# EAGLE design SparkFun_Bar_Graph_Breakout (EAGLE 7.2.0)
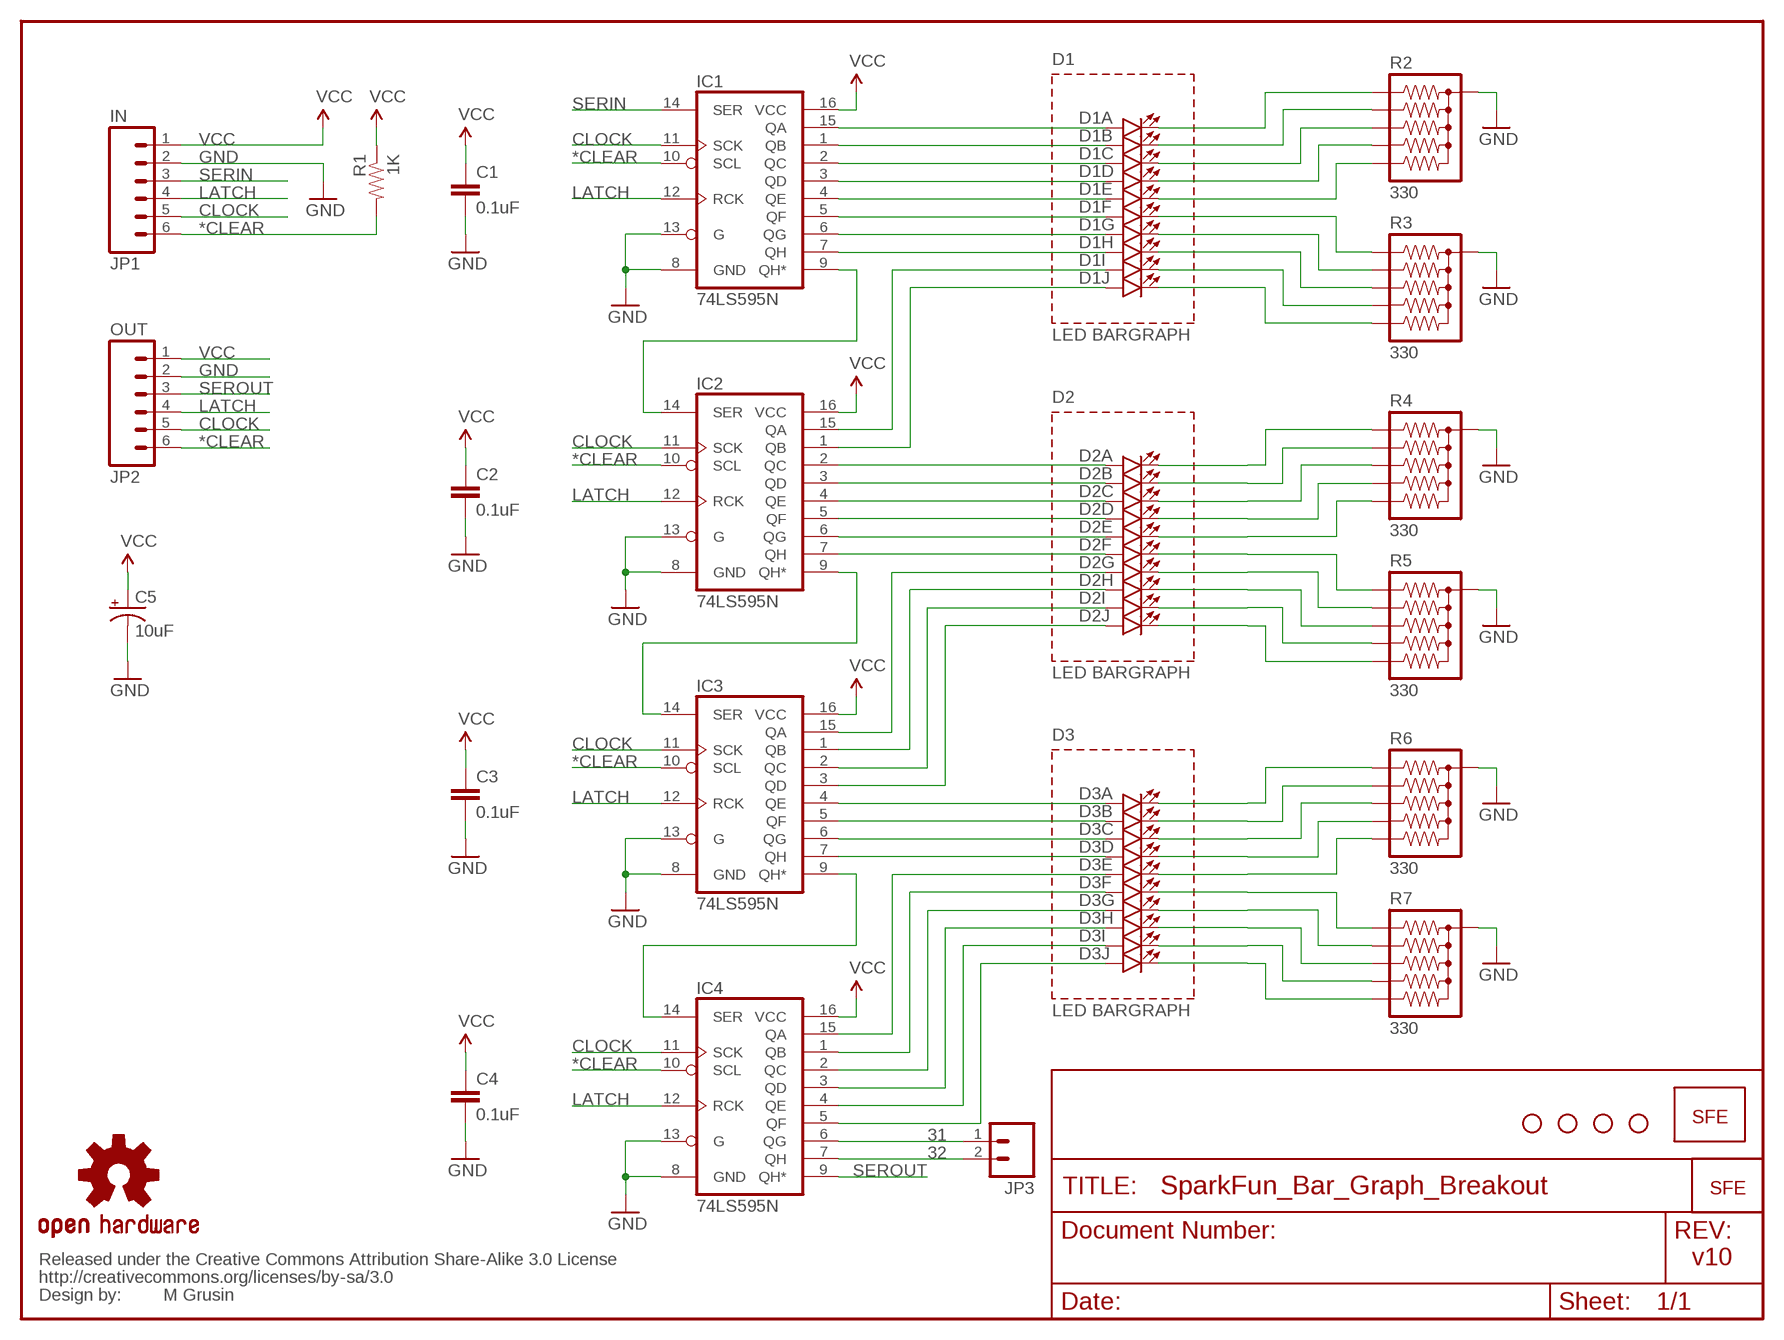
[diagram p0: schematic, sheet 1]

## Parts
C1  0.1uF  CAPPTH2  [CAP-PTH-SMALL2]
C2  0.1uF  CAPPTH2  [CAP-PTH-SMALL2]
C3  0.1uF  CAPPTH2  [CAP-PTH-SMALL2]
C4  0.1uF  CAPPTH2  [CAP-PTH-SMALL2]
C5  10uF  CAP_POLPTH2  [CPOL-RADIAL-10UF-25V]
D1  LED_BARGRAPH_10  [LED_BARGAPH_10]
D2  LED_BARGRAPH_10  [LED_BARGAPH_10]
D3  LED_BARGRAPH_10  [LED_BARGAPH_10]
IC1  74LS595N  [DIL16]
IC2  74LS595N  [DIL16]
IC3  74LS595N  [DIL16]
IC4  74LS595N  [DIL16]
JP1  IN  M06SIP  [1X06]
JP2  OUT  M06SIP  [1X06]
JP3  M02PTH  [1X02]
LOGO1  LOGO-SFENW2  [SFE-NEW-WEB]
LOGO2  LOGO-SFESK  [SFE-LOGO-FLAME]
R1  1K  RESISTORAXIAL-0.3  [AXIAL-0.3]
R2  330  RPACK-BUSSED-SIP-PTH-5  [RPACK-SIP-PTH-5]
R3  330  RPACK-BUSSED-SIP-PTH-5  [RPACK-SIP-PTH-5]
R4  330  RPACK-BUSSED-SIP-PTH-5  [RPACK-SIP-PTH-5]
R5  330  RPACK-BUSSED-SIP-PTH-5  [RPACK-SIP-PTH-5]
R6  330  RPACK-BUSSED-SIP-PTH-5  [RPACK-SIP-PTH-5]
R7  330  RPACK-BUSSED-SIP-PTH-5  [RPACK-SIP-PTH-5]
SO1  STAND-OFF  [STAND-OFF]
SO2  STAND-OFF  [STAND-OFF]
SO3  STAND-OFF  [STAND-OFF]
SO4  STAND-OFF  [STAND-OFF]
U$5  OSHW-LOGOM  [OSHW-LOGO-M]
U$6  CREATIVE_COMMONS  [CREATIVE_COMMONS]

## Nets
31: IC4.6(QG) JP3.1
32: IC4.7(QH) JP3.2
*CLEAR: IC1.10(SCL) IC2.10(SCL) IC3.10(SCL) IC4.10(SCL) JP1.6 JP2.6 R1.P$2
CLOCK: IC1.11(SCK) IC2.11(SCK) IC3.11(SCK) IC4.11(SCK) JP1.5 JP2.5
GND: C1.2 C2.2 C3.2 C4.2 C5.2(-) IC1.8(GND) IC1.13(G) IC2.8(GND) IC2.13(G) IC3.8(GND) IC3.13(G) IC4.8(GND) IC4.13(G) JP1.2 JP2.2 R2.P$1 R3.P$1 R4.P$1 R5.P$1 R6.P$1 R7.P$1
LATCH: IC1.12(RCK) IC2.12(RCK) IC3.12(RCK) IC4.12(RCK) JP1.4 JP2.4
N$1: D1.1(A:A) IC1.15(QA)
N$2: D1.2(B:A) IC1.1(QB)
N$3: D1.3(C:A) IC1.2(QC)
N$4: D1.4(D:A) IC1.3(QD)
N$5: D1.5(E:A) IC1.4(QE)
N$6: D1.6(F:A) IC1.5(QF)
N$7: D1.7(G:A) IC1.6(QG)
N$8: D1.8(H:A) IC1.7(QH)
N$9: D1.9(I:A) IC2.15(QA)
N$10: D1.10(J:A) IC2.1(QB)
N$11: D2.8(H:A) IC3.1(QB)
N$12: D2.7(G:A) IC3.15(QA)
N$13: D2.9(I:A) IC3.2(QC)
N$14: D2.10(J:A) IC3.3(QD)
N$15: D3.1(A:A) IC3.4(QE)
N$16: D3.2(B:A) IC3.5(QF)
N$17: D3.3(C:A) IC3.6(QG)
N$18: D3.4(D:A) IC3.7(QH)
N$19: D2.1(A:A) IC2.2(QC)
N$20: D2.2(B:A) IC2.3(QD)
N$21: D2.3(C:A) IC2.4(QE)
N$22: D2.4(D:A) IC2.5(QF)
N$23: D2.5(E:A) IC2.6(QG)
N$24: D2.6(F:A) IC2.7(QH)
N$25: D1.20(A:C) R2.P$2
N$26: D1.19(B:C) R2.P$3
N$27: D3.5(E:A) IC4.15(QA)
N$28: D3.6(F:A) IC4.1(QB)
N$29: D1.18(C:C) R2.P$4
N$30: D1.17(D:C) R2.P$5
N$31: D1.16(E:C) R2.P$6
N$32: D1.15(F:C) R3.P$2
N$33: D1.14(G:C) R3.P$3
N$34: D1.13(H:C) R3.P$4
N$35: D1.12(I:C) R3.P$5
N$36: D1.11(J:C) R3.P$6
N$37: D2.20(A:C) R4.P$2
N$38: D2.19(B:C) R4.P$3
N$39: D3.7(G:A) IC4.2(QC)
N$40: D3.8(H:A) IC4.3(QD)
N$41: D3.9(I:A) IC4.4(QE)
N$42: D3.10(J:A) IC4.5(QF)
N$43: D2.18(C:C) R4.P$4
N$44: D2.17(D:C) R4.P$5
N$45: D2.16(E:C) R4.P$6
N$46: D2.15(F:C) R5.P$2
N$47: D2.14(G:C) R5.P$3
N$48: D2.13(H:C) R5.P$4
N$49: D2.12(I:C) R5.P$5
N$50: D2.11(J:C) R5.P$6
N$51: D3.20(A:C) R6.P$2
N$52: D3.19(B:C) R6.P$3
N$53: D3.18(C:C) R6.P$4
N$54: D3.17(D:C) R6.P$5
N$55: D3.16(E:C) R6.P$6
N$56: D3.15(F:C) R7.P$2
N$57: D3.14(G:C) R7.P$3
N$58: D3.13(H:C) R7.P$4
N$59: D3.12(I:C) R7.P$5
N$60: D3.11(J:C) R7.P$6
N$65: IC1.9(QH*) IC2.14(SER)
N$66: IC2.9(QH*) IC3.14(SER)
N$67: IC3.9(QH*) IC4.14(SER)
SERIN: IC1.14(SER) JP1.3
SEROUT: IC4.9(QH*) JP2.3
VCC: C1.1 C2.1 C3.1 C4.1 C5.1(+) IC1.16(VCC) IC2.16(VCC) IC3.16(VCC) IC4.16(VCC) JP1.1 JP2.1 R1.P$1

## Notes on the sheet
- D1
- LED BARGRAPH
- D2
- LED BARGRAPH
- D3
- LED BARGRAPH
- v10
- M Grusin

## Library data of the parts
C1-C4 = SparkFun:CAP: Capacitor Standard 0603 ceramic capacitor, and 0.1" leaded capacitor.
C5 = SparkFun:CAP_POL: Capacitor Polarized These are standard SMD and PTH capacitors. Normally 10uF, 47uF, and 100uF in electrolytic and tantalum varieties. Always verify the external diameter of the through hole cap, it varies with capacity, voltage, and manufacturer. The EIA devices should be standard.
D1-D3 = SparkFun:LED_BARGRAPH_10: 10-Segment LED Bar Graph SFE part numbers: COM-09935 (red, Vf = 2.1V, Ifmax = 20mA) COM-09936 (yellow, Vf = 2.1V, Ifmax = 20mA) COM-09937 (blue, Vf = 3.4V, Ifmax = 20mA) COM-09938 (green, Vf = 3.4V, Ifmax = 20mA)
IC1-IC4 = SparkFun:74*595: 8-bit SHIFT REGISTER, output latch
JP1 JP2 = SparkFun:M06: Header 6 Standard 6-pin 0.1" header. Use with straight break away headers (SKU : PRT-00116), right angle break away headers (PRT-00553), swiss pins (PRT-00743), machine pins (PRT-00117), and female headers (PRT-00115). Molex polarized connector foot print use with SKU : PRT-08094 with associated crimp pins and housings. NOTES ON THE VARIANTS LOCK and LOCK_LONGPADS... This footprint was designed to help hold the alignment of a through-hole component (i.e. 6-pin header) while soldering it into place. You may notice that each hole has been shifted either up or down by 0.005 of an inch from it's more standard position (which is a perfectly straight line). This slight alteration caused the pins (the squares in the middle) to touch the edges of the holes. Because they are alternating, it causes a "brace" to hold the component in place. 0.005 has proven to be the perfect amount of "off-center" position when using our standard breakaway headers. Although looks a little odd when you look at the bare footprint, once you have a header in there, the alteration is very hard to notice. Also, if you push a header all the way into place, it is covered up entirely on the bottom side. This idea of altering the position of holes to aid alignment will be further integrated into the Sparkfun Library for other footprints. It can help hold any component with 3 or more connection pins.
JP3 = SparkFun:M02: Header 2 Standard 2-pin 0.1" header. Use with straight break away headers (SKU : PRT-00116), right angle break away headers (PRT-00553), swiss pins (PRT-00743), machine pins (PRT-00117), and female headers (PRT-00115). Molex polarized connector foot print use with SKU : PRT-08233 with associated crimp pins and housings.
LOGO1 LOGO2 = SparkFun:LOGO-SFE: Spark Fun Electronics PCB Logo This is the standard Spark Fun Electronics PCB logo.
R1 = SparkFun:RESISTOR: Resistor Basic schematic elements and footprints for 0603, 1206, and PTH resistors.
R2-R7 = SparkFun:RPACK*: BOURNS 4600X series thick-film SIP resistor packs Five resistors bussed to a single pin (denoted by dot). 0.2W / resistor datasheet <http://dlnmh9ip6v2uc.cloudfront.net/datasheets/Components/General/4600x.pdf> SFE parts COM-10855 (330), COM-10856 (10K)
SO1-SO4 = SparkFun:STAND-OFF: Stand Off This is the mechanical footprint for a #4 phillips button head screw. Use the keepout ring to avoid running the screw head into surrounding components. SKU : PRT-00447
U$5 = SparkFun:OSHW-LOGO: Open Source Hardware Logo This logo indicates the piece of hardware it is found on incorporates a OSHW license and/or adheres to the definition of open source hardware found here: http://freedomdefined.org/OSHW
U$6 = SparkFun:CREATIVE_COMMONS

## Board
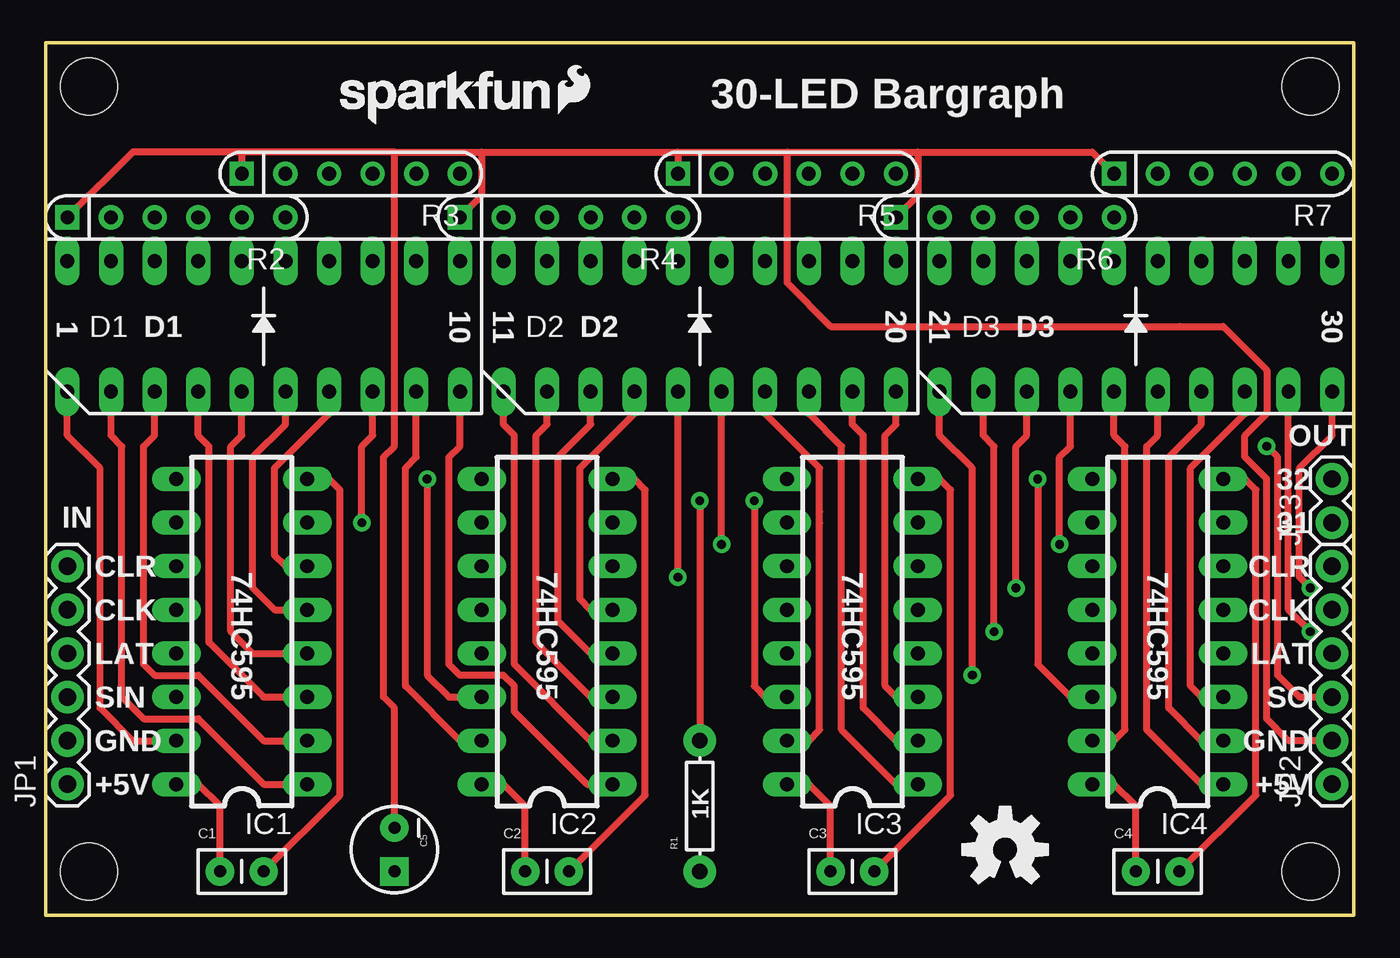
[diagram p1: board, top side]
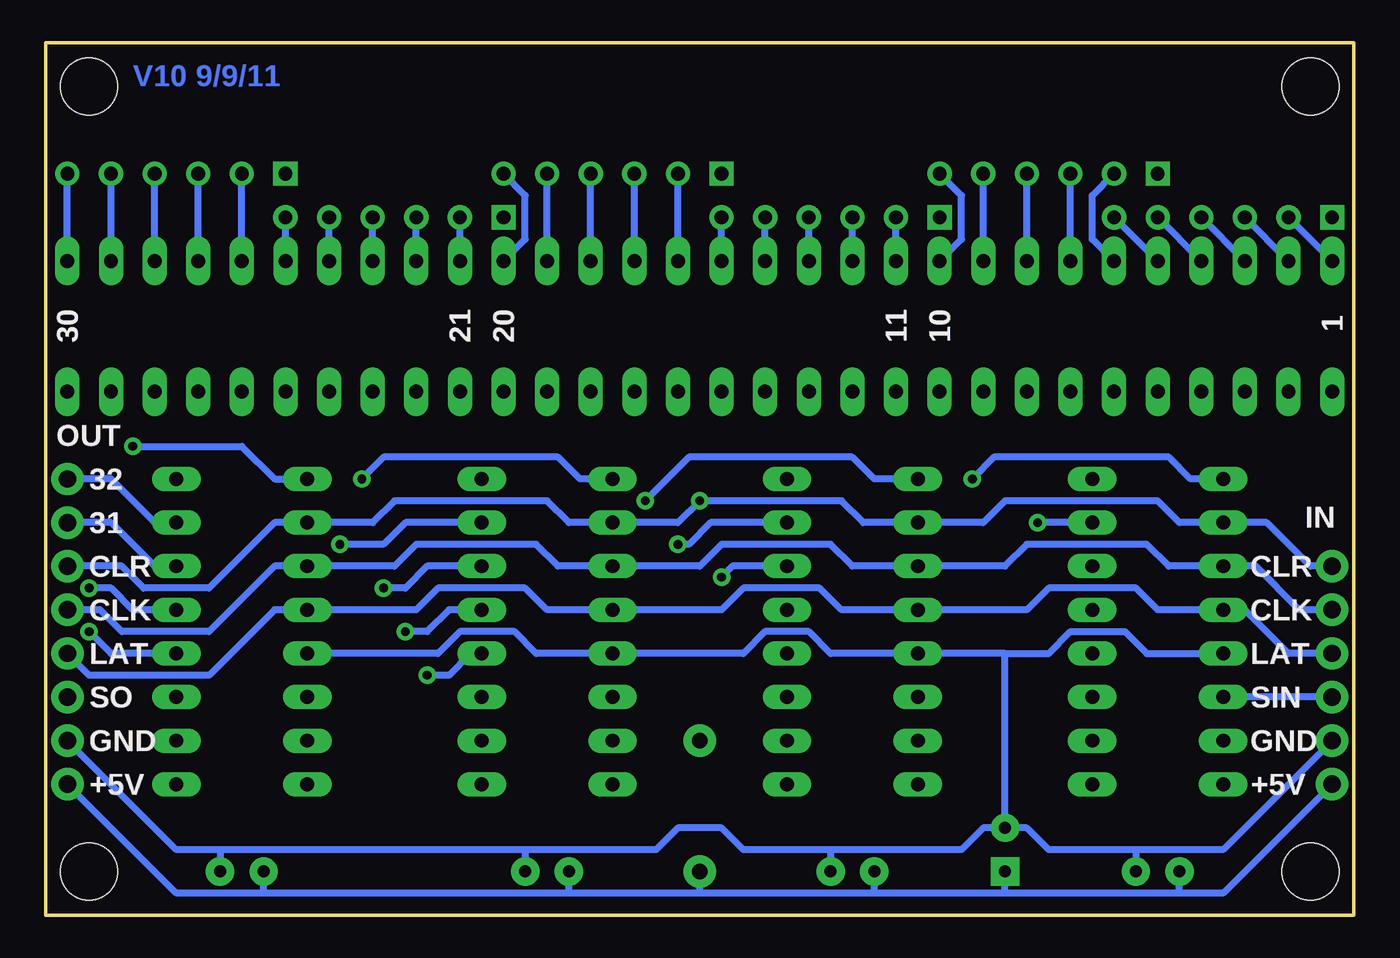
[diagram p2: board, bottom side, seen from below]

Size 76.2 x 50.8 mm. Coordinates in mm from the lower left corner, seen from the top.
Outline: 0,0 76.18,0 76.2,50.8 0,50.8 0,0
Copper layers (1*16): Top 0.035mm / dielectric 1.5mm / Bottom 0.035mm
Design rules "SparkFun": minimum track width 8mil, minimum drill 20mil, track to track 8mil, track to pad 8mil, pad to pad 8mil, via to via 8mil, smd to smd 8mil, copper to edge 8mil, drill to drill 8mil, minimum pad ring 12mil, minimum via ring 10mil, stop-mask expansion 4mil, vias tented up to drill 20mil, thermal gap 10mil

### Footprints (pad centres in the part's own frame; a part is rotated, then mirrored left to right if it is on the bottom)
CAP-PTH-SMALL2 = drill 0.7 pad 1.651: 1 0,0; 2 2.54,0
CPOL-RADIAL-10UF-25V = drill 0.7 pad 1.651 square: 1 1.27,0 | drill 0.7 pad 1.651: 2 -1.27,0
LED_BARGAPH_10 = drill 0.813 long: 1 -11.43,-3.81; 2 -8.89,-3.81; 3 -6.35,-3.81; 4 -3.81,-3.81; 5 -1.27,-3.81; 6 1.27,-3.81; 7 3.81,-3.81; 8 6.35,-3.81; 9 8.89,-3.81; 10 11.43,-3.81; 11 11.43,3.81; 12 8.89,3.81; 13 6.35,3.81; 14 3.81,3.81; 15 1.27,3.81; 16 -1.27,3.81; 17 -3.81,3.81; 18 -6.35,3.81; 19 -8.89,3.81; 20 -11.43,3.81
DIL16 = drill 0.813 long: 1 -8.89,-3.81; 2 -6.35,-3.81; 3 -3.81,-3.81; 4 -1.27,-3.81; 5 1.27,-3.81; 6 3.81,-3.81; 7 6.35,-3.81; 8 8.89,-3.81; 9 8.89,3.81; 10 6.35,3.81; 11 3.81,3.81; 12 1.27,3.81; 13 -1.27,3.81; 14 -3.81,3.81; 15 -6.35,3.81; 16 -8.89,3.81
1X06 = drill 1.016 pad 1.88: 1 0,0; 2 2.54,0; 3 5.08,0; 4 7.62,0; 5 10.16,0; 6 12.7,0
1X02 = drill 1.016 pad 1.88: 1 0,0; 2 2.54,0
AXIAL-0.3 = drill 0.9 pad 1.88: P$1 -3.81,0; P$2 3.81,0
RPACK-SIP-PTH-5 = drill 0.8 square: P$1 0,0 | drill 0.8: P$2 0,-2.54; P$3 0,-5.08; P$4 0,-7.62; P$5 0,-10.16; P$6 0,-12.7
STAND-OFF = hole 3.302: 0,0

### Placement (x,y rotation side)
C1  10.16,2.54 0 top
C2  27.94,2.54 0 top
C3  45.72,2.54 0 top
C4  63.5,2.54 0 top
C5  20.32,3.81 270 top
D1  12.7,34.29 0 top
D2  38.1,34.29 0 top
D3  63.5,34.29 0 top
IC1  11.43,16.51 90 top
IC2  29.21,16.51 90 top
IC3  46.99,16.51 90 top
IC4  64.77,16.51 90 top
JP1  1.27,7.62 90 top
JP2  74.93,7.62 90 top
JP3  74.93,22.86 90 top
LOGO1  17.14,46.04 0 top
LOGO2  29.84,46.67 0 top
R1  38.1,6.35 90 top
R2  1.27,40.64 90 top
R3  11.43,43.18 90 top
R4  24.13,40.64 90 top
R5  36.83,43.18 90 top
R6  49.53,40.64 90 top
R7  62.23,43.18 90 top
SO1  2.54,48.26 0 top
SO2  73.66,48.26 0 top
SO3  73.66,2.54 0 top
SO4  2.54,2.54 0 top
U$5  55.88,3.81 0 top
U$6  3.81,-19.05 0 top  (outside the outline)

### Tracks (layer width: path | path; a pad name or v marks a point on that pad's centre or on a via)
31
  Bottom 0.406: IC4.6 69.85,20.32 72.39,22.86 JP3.1
32
  Bottom 0.406: JP3.2 72.39,25.4 69.85,22.86 IC4.7
*CLEAR  (via drill 0.51)
  Top 0.406: v38.1,24.13 R1.P$2
  Bottom 0.406: JP1.6 2.54,20.32 5.08,22.86 IC1.10 10.16,22.86 11.43,24.13 20.32,24.13 21.59,22.86 IC2.10 28.57,22.86 29.84,24.13 v38.1,24.13 39.37,22.86 IC3.10 45.72,22.86 46.99,24.13 55.88,24.13 57.15,22.86 IC4.10 62.87,22.86 66.67,19.05 70.48,19.05 71.75,20.32 JP2.6
CLOCK
  Bottom 0.406: JP1.5 3.17,17.78 5.71,20.32 IC1.11 10.79,20.32 12.06,21.59 19.05,21.59 20.32,20.32 IC2.11 29.21,20.32 30.48,21.59 36.83,21.59 38.1,20.32 IC3.11 46.35,20.32 47.62,21.59 54.61,21.59 55.88,20.32 IC4.11 62.87,20.32 66.67,16.51 71.75,16.51 73.03,17.78 JP2.5
GND
  Top 0.406: IC1.8 16.51,25.4 17.14,24.77 17.14,6.99 C1.2 | IC2.8 34.29,25.4 34.92,24.77 34.92,6.99 C2.2 | IC3.8 52.07,25.4 52.7,24.77 52.7,6.99 C3.2 | IC4.8 69.85,25.4 70.48,24.77 70.48,6.99 C4.2 | C5.2 20.32,12.06 19.68,12.7 19.68,26.67 20.32,27.3 20.32,34.29 20.32,44.45 | R2.P$1 5.08,44.45 11.43,44.45 | 20.32,44.45 11.43,44.45 | 20.32,44.45 25.4,44.45 | 25.4,44.45 36.83,44.45 | 36.83,44.45 43.18,44.45 | 43.18,44.45 50.8,44.45 | 50.8,44.45 60.96,44.45 R7.P$1 | 11.43,44.45 R3.P$1 | R4.P$1 25.4,41.91 25.4,44.45 | 36.83,44.45 R5.P$1 | R6.P$1 50.8,41.91 50.8,44.45 | JP2.2 72.39,10.16 71.12,11.43 71.12,25.4 69.85,26.67 69.85,27.94 71.12,29.21 71.12,31.75 68.58,34.29 66.04,34.29 45.72,34.29 43.18,36.83 43.18,44.45
  Bottom 0.406: C5.2 19.05,5.08 17.78,3.81 12.7,3.81 | 12.7,3.81 C1.2 | 12.7,3.81 7.62,3.81 JP1.2 | C5.2 21.59,5.08 22.86,3.81 30.48,3.81 | 30.48,3.81 C2.2 | JP2.2 68.58,3.81 66.04,3.81 | 66.04,3.81 C4.2 | 48.26,3.81 66.04,3.81 | 48.26,3.81 C3.2 | 30.48,3.81 35.56,3.81 36.83,5.08 39.37,5.08 40.64,3.81 48.26,3.81 | IC4.13 53.34,15.24 52.07,16.51 48.9,16.51 47.62,15.24 IC3.13 35.56,15.24 34.29,16.51 31.75,16.51 30.48,15.24 IC2.13 20.32,15.24 | IC1.13 12.06,15.24 13.34,16.51 16.51,16.51 17.78,15.24 20.32,15.24 | C5.2 20.32,15.24
LATCH
  Bottom 0.406: JP1.4 3.81,15.24 6.35,17.78 IC1.12 11.43,17.78 12.7,19.05 17.78,19.05 19.05,17.78 IC2.12 29.84,17.78 31.11,19.05 35.56,19.05 36.83,17.78 IC3.12 46.99,17.78 48.26,19.05 53.34,19.05 54.61,17.78 IC4.12 62.87,17.78 66.67,13.97 73.66,13.97 JP2.4
N$1
  Top 0.406: D1.1 1.27,27.94 3.17,26.04 3.17,12.06 5.08,10.16 IC1.15
N$2
  Top 0.406: IC1.1 12.7,7.62 8.89,11.43 5.71,11.43 4.45,12.7 4.45,27.3 3.81,27.94 D1.2
N$3
  Top 0.406: D1.3 6.35,27.94 5.71,27.3 5.71,14.61 6.35,13.97 8.89,13.97 12.7,10.16 IC1.2
N$4
  Top 0.406: IC1.3 12.7,12.7 9.53,15.88 9.53,27.3 8.89,27.94 D1.4
N$5
  Top 0.406: D1.5 11.43,27.94 10.79,27.3 10.79,16.51 12.06,15.24 IC1.4
N$6
  Top 0.406: IC1.5 13.34,17.78 12.06,19.05 12.06,26.67 13.97,28.57 D1.6
N$7
  Top 0.406: D1.7 16.51,29.21 13.34,26.04 13.34,20.95 13.97,20.32 IC1.6
N$8  (via drill 0.51)
  Top 0.406: v18.41,22.86 18.41,27.3 19.05,27.94 D1.8
  Bottom 0.406: IC1.7 v18.41,22.86
N$9
  Top 0.406: D1.9 21.59,26.67 20.95,26.04 20.95,13.34 24.13,10.16 IC2.15
N$10
  Top 0.406: D1.10 24.13,27.3 23.5,26.67 23.5,14.61 24.13,13.97 26.67,13.97 27.3,13.34 27.3,11.85 31.53,7.62 IC2.1
N$11
  Top 0.406: IC3.1 49.53,7.62 46.35,10.79 46.35,27.3 44.45,29.21 D2.8
N$12
  Top 0.406: D2.7 41.91,29.21 45.09,26.04 45.09,23.5 45.09,22.86 45.09,10.79 44.45,10.16 IC3.15
N$13
  Top 0.406: D2.9 46.99,28.57 47.62,27.94 47.62,12.06 49.53,10.16 IC3.2
N$14
  Top 0.406: IC3.3 49.53,12.7 48.9,13.34 48.9,27.94 49.53,28.57 D2.10
N$15  (via drill 0.51)
  Top 0.406: D3.1 52.07,27.94 53.98,26.04 v53.98,13.97
  Bottom 0.406: IC3.4 51.44,15.24 52.7,13.97 v53.98,13.97
N$16  (via drill 0.51)
  Top 0.406: D3.2 54.61,27.94 55.24,27.3 v55.24,16.51
  Bottom 0.406: IC3.5 52.7,17.78 53.98,16.51 v55.24,16.51
N$17  (via drill 0.51)
  Top 0.406: D3.3 57.15,27.94 56.52,27.3 v56.52,19.05
  Bottom 0.406: IC3.6 53.98,20.32 55.24,19.05 v56.52,19.05
N$18  (via drill 0.51)
  Top 0.406: D3.4 59.69,27.3 59.05,26.67 v59.05,21.59
  Bottom 0.406: IC3.7 55.24,22.86 56.52,21.59 v59.05,21.59
N$19
  Top 0.406: IC2.2 31.75,10.16 27.3,14.61 27.3,27.94 26.67,28.57 D2.1
N$20
  Top 0.406: D2.2 29.21,28.57 28.57,27.94 28.57,15.88 31.75,12.7 IC2.3
N$21
  Top 0.406: D2.3 31.75,28.57 29.84,26.67 29.84,17.14 31.75,15.24 IC2.4
N$22
  Top 0.406: D2.4 34.29,29.21 31.11,26.04 31.11,18.41 31.75,17.78 IC2.5
N$23  (via drill 0.51)
  Top 0.406: v36.83,19.68 D2.5
  Bottom 0.406: IC2.6 36.2,20.32 v36.83,19.68
N$24  (via drill 0.51)
  Top 0.406: v39.37,21.59 D2.6
  Bottom 0.406: IC2.7 37.47,22.86 38.73,21.59 v39.37,21.59
N$25
  Bottom 0.406: D1.20 R2.P$2
N$26
  Bottom 0.406: D1.19 R2.P$3
N$27
  Top 0.406: IC4.15 62.23,10.16 62.87,10.79 62.87,27.3 62.23,27.94 D3.5
N$28
  Top 0.406: D3.6 64.77,27.94 64.14,27.3 64.14,10.79 67.31,7.62 IC4.1
N$29
  Bottom 0.406: D1.18 R2.P$4
N$30
  Bottom 0.406: D1.17 R2.P$5
N$31
  Bottom 0.406: D1.16 R2.P$6
N$32
  Bottom 0.406: D1.15 15.24,39.37 15.24,41.91 R3.P$2
N$33
  Bottom 0.406: D1.14 R3.P$3
N$34
  Bottom 0.406: D1.13 R3.P$4
N$35
  Bottom 0.406: D1.12 R3.P$5
N$36
  Bottom 0.406: D1.11 22.86,39.37 22.86,41.91 R3.P$6
N$37
  Bottom 0.406: D2.20 R4.P$2
N$38
  Bottom 0.406: D2.19 R4.P$3
N$39
  Top 0.406: IC4.2 67.31,10.16 65.41,12.06 65.41,26.67 67.31,28.57 D3.7
N$40
  Top 0.406: D3.8 69.85,29.21 66.67,26.04 66.67,13.34 67.31,12.7 IC4.3
N$41  (via drill 0.51)
  Top 0.406: D3.9 72.39,29.21 72.39,27.3 72.39,17.78 v73.66,16.51
  Bottom 0.406: v73.66,16.51 72.39,15.24 IC4.4
N$42  (via drill 0.51)
  Top 0.406: D3.10 74.93,27.94 73.03,26.04 73.03,19.68 v73.66,19.05
  Bottom 0.406: v73.66,19.05 72.39,19.05 71.12,17.78 IC4.5
N$43
  Bottom 0.406: D2.18 R4.P$4
N$44
  Bottom 0.406: D2.17 R4.P$5
N$45
  Bottom 0.406: D2.16 R4.P$6
N$46
  Bottom 0.406: D2.15 R5.P$2
N$47
  Bottom 0.406: D2.14 R5.P$3
N$48
  Bottom 0.406: D2.13 R5.P$4
N$49
  Bottom 0.406: D2.12 R5.P$5
N$50
  Bottom 0.406: D2.11 48.26,39.37 48.26,41.91 R5.P$6
N$51
  Bottom 0.406: D3.20 R6.P$2
N$52
  Bottom 0.406: D3.19 R6.P$3
N$53
  Bottom 0.406: D3.18 R6.P$4
N$54
  Bottom 0.406: D3.17 R6.P$5
N$55
  Bottom 0.406: D3.16 R6.P$6
N$56
  Bottom 0.406: D3.15 R7.P$2
N$57
  Bottom 0.406: D3.14 R7.P$3
N$58
  Bottom 0.406: D3.13 R7.P$4
N$59
  Bottom 0.406: D3.12 R7.P$5
N$60
  Bottom 0.406: D3.11 R7.P$6
N$65  (via drill 0.51)
  Top 0.406: v22.23,25.4 22.23,13.97 23.5,12.7 IC2.14
  Bottom 0.406: IC1.9 9.53,25.4 10.79,26.67 20.95,26.67 v22.23,25.4
N$66  (via drill 0.51)
  Top 0.406: v41.27,24.13 41.27,13.34 41.91,12.7 IC3.14
  Bottom 0.406: IC2.9 27.94,25.4 29.21,26.67 38.73,26.67 v41.27,24.13
N$67  (via drill 0.51)
  Top 0.406: v57.78,25.4 57.78,14.61 59.69,12.7 IC4.14
  Bottom 0.406: IC3.9 45.09,25.4 46.35,26.67 56.52,26.67 v57.78,25.4
SERIN
  Bottom 0.406: JP1.3 IC1.14
SEROUT  (via drill 0.51)
  Top 0.406: JP2.3 73.03,12.7 71.75,13.97 71.75,26.67 v71.12,27.3
  Bottom 0.406: v71.12,27.3 64.77,27.3 62.87,25.4 IC4.9
VCC
  Top 0.406: C1.1 10.16,6.35 8.89,7.62 IC1.16 | C2.1 27.94,6.35 26.67,7.62 IC2.16 | C3.1 45.72,6.35 44.45,7.62 IC3.16 | C4.1 63.5,6.35 62.23,7.62 IC4.16
  Bottom 0.406: JP1.1 7.62,1.27 10.16,1.27 | 10.16,1.27 C1.1 | 20.32,1.27 C5.1 | 10.16,1.27 20.32,1.27 | 27.94,1.27 C2.1 | 20.32,1.27 27.94,1.27 | 38.1,1.27 R1.P$1 | 27.94,1.27 38.1,1.27 | 38.1,1.27 45.72,1.27 | 45.72,1.27 C3.1 | 45.72,1.27 63.5,1.27 | 63.5,1.27 C4.1 | 63.5,1.27 68.58,1.27 JP2.1

### Text on the board
Bottom: V10 9/9/11
tPlace: 30-LED Bargraph | 1 | 10 | 11 | 20 | 21 | 30 | D1 | D2 | D3 | OUT | 32 | IN | 31 | CLR | CLR | 74HC595 | 74HC595 | 74HC595 | 74HC595 | CLK | CLK | LAT | LAT | SO | SIN | GND | GND | +5V | +5V
bPlace: 1 | 10 | 11 | 20 | 21 | 30 | OUT | 32 | IN | 31 | CLR | CLR | CLK | CLK | LAT | LAT | SIN | SO | GND | GND | +5V | +5V
tValues: M Grusin
Document: 2.00" | 1.90" | 1.55" | 1.15" | 0.10" | 0.00" | 0.00" | 0.10" | 2.90" | 3.00"